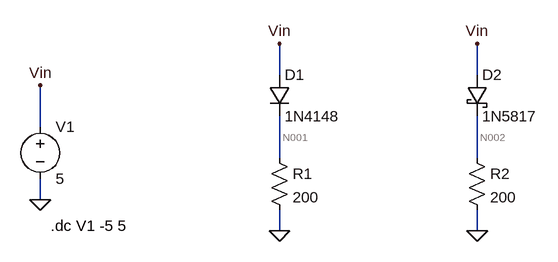
[diagram p0: schematic lab1part1.asc]
lab1part1.asc, the LTspice schematic file:
Version 4
SHEET 1 880 680
WIRE 432 48 432 0
WIRE 736 48 736 0
WIRE 64 128 64 64
WIRE 432 176 432 112
WIRE 736 176 736 112
WIRE 64 240 64 208
WIRE 432 288 432 256
WIRE 736 288 736 256
FLAG 64 240 0
FLAG 64 64 Vin
FLAG 432 0 Vin
FLAG 432 288 0
FLAG 736 0 Vin
FLAG 736 288 0
SYMBOL voltage 64 112 R0
WINDOW 123 0 0 Left 0
WINDOW 39 0 0 Left 0
SYMATTR InstName V1
SYMATTR Value 5
SYMBOL res 416 160 R0
SYMATTR InstName R1
SYMATTR Value 200
SYMBOL diode 416 48 R0
SYMATTR InstName D1
SYMATTR Value 1N4148
SYMBOL res 720 160 R0
SYMATTR InstName R2
SYMATTR Value 200
SYMBOL schottky 720 48 R0
SYMATTR InstName D2
SYMATTR Value 1N5817
SYMATTR Description Diode
SYMATTR Type diode
TEXT 80 280 Left 2 !.dc V1 -5 5

The netlist it stands for:
* lab1part1.asc
V1 Vin 0 5
R1 N001 0 200
D1 Vin N001 1N4148
R2 N002 0 200
D2 Vin N002 1N5817
.model D D
.lib standard.dio
.dc V1 -5 5
.backanno
.end

* Results of the author's LTspice run, read from the files saved beside the schematic
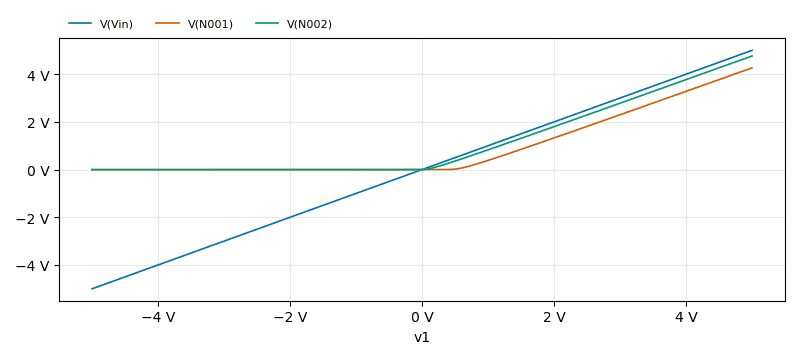
[diagram p1: DC transfer characteristic of lab1part1.asc, plotted from the saved traces]
* DC transfer characteristic, 1 run:
*   V(Vin): -5 V at v1=-5 V, 5 V at v1=5 V, min -5 V, max 5 V
*   V(N001): -505 nV at v1=-5 V, 4.265 V at v1=5 V, min -505 nV, max 4.265 V
*   V(N002): -6.34 mV at v1=-5 V, 4.764 V at v1=5 V, min -6.34 mV, max 4.764 V